# Altium schematic sheet motor endcap.SchDoc
size A; SheetNumber: 1; SheetTotal: 1
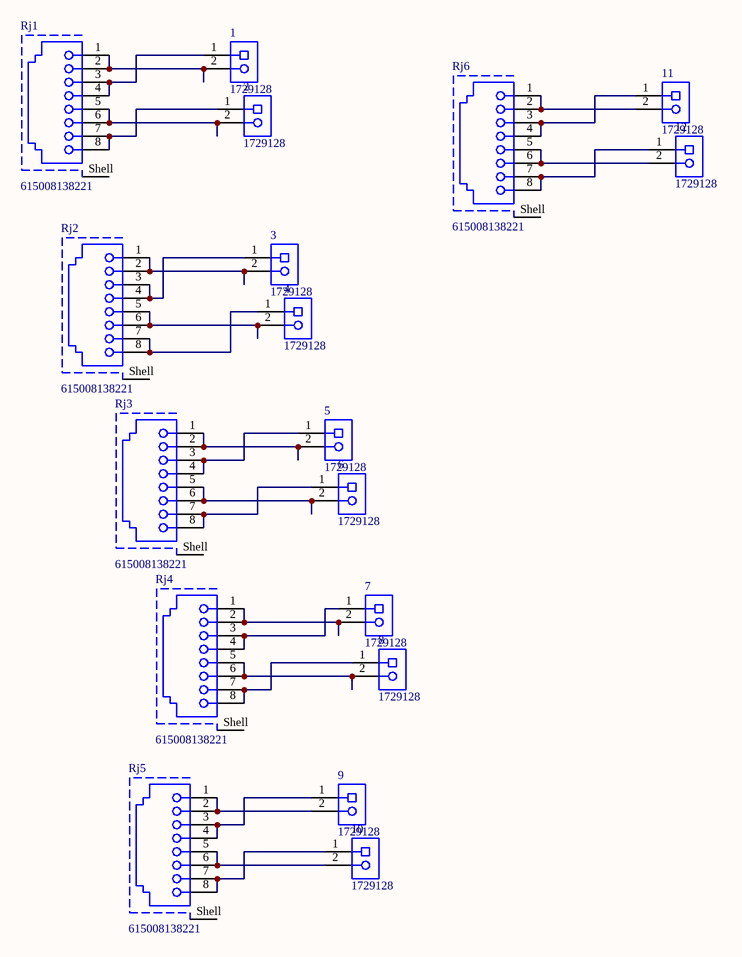
[diagram p0: motor endcap.SchDoc]

## Parts
1  1729128  [PHOE-1729128-2_V]
2  1729128  [PHOE-1729128-2_V]
3  1729128  [PHOE-1729128-2_V]
4  1729128  [PHOE-1729128-2_V]
5  1729128  [PHOE-1729128-2_V]
6  1729128  [PHOE-1729128-2_V]
7  1729128  [PHOE-1729128-2_V]
8  1729128  [PHOE-1729128-2_V]
9  1729128  [PHOE-1729128-2_V]
10  1729128  [PHOE-1729128-2_V]
11  1729128  [PHOE-1729128-2_V]
12  1729128  [PHOE-1729128-2_V]
Rj1  615008138221  [615008138221]
Rj2  615008138221  [615008138221]
Rj3  615008138221  [615008138221]
Rj4  615008138221  [615008138221]
Rj5  615008138221  [615008138221]
Rj6  615008138221  [615008138221]

## Nets
Net1_1: 1.1 Rj1.3 Rj1.4
Net1_2: 1.2 Rj1.1 Rj1.2
Net2_1: 2.1 Rj1.7 Rj1.8
Net2_2: 2.2 Rj1.5 Rj1.6
Net3_1: 3.1 Rj2.3 Rj2.4
Net3_2: 3.2 Rj2.1 Rj2.2
Net4_1: 4.1 Rj2.7 Rj2.8
Net4_2: 4.2 Rj2.5 Rj2.6
Net5_1: 5.1 Rj3.3 Rj3.4
Net5_2: 5.2 Rj3.1 Rj3.2
Net6_1: 6.1 Rj3.7 Rj3.8
Net6_2: 6.2 Rj3.5 Rj3.6
Net7_1: 7.1 Rj4.3 Rj4.4
Net7_2: 7.2 Rj4.1 Rj4.2
Net8_1: 8.1 Rj4.7 Rj4.8
Net8_2: 8.2 Rj4.5 Rj4.6
Net9_1: 9.1 Rj5.3 Rj5.4
Net9_2: 9.2 Rj5.1 Rj5.2
Net10_1: 10.1 Rj5.7 Rj5.8
Net10_2: 10.2 Rj5.5 Rj5.6
Net11_1: 11.1 Rj6.3 Rj6.4
Net11_2: 11.2 Rj6.1 Rj6.2
Net12_1: 12.1 Rj6.7 Rj6.8
Net12_2: 12.2 Rj6.5 Rj6.6

Not connected (* = marked no-connect by the designer): Rj1 Shell; Rj2 Shell; Rj3 Shell; Rj4 Shell; Rj5 Shell; Rj6 Shell

## Library data of the parts
1-12 = CMP-2000-05815-1: PCB Terminal Block, 13.5 A, 400 V, 2-Pin THD, RoHS, Bulk; Manufacturer: Phoenix Contact; Package Version: 03/2015; No. of Rows: 1; Pitch: 5.08mm; No. of Positions: 2; Voltage Rating: 400V; Current Rating: 13500mA; Manufacturer URL: http://www.phoenixcontact.com/; Datasheet URL: https://datasheet.ciiva.com/16046/1729128-16046181.pdf; RoHS: TRUE; Package URL: https://www.phoenixcontact.com/online/portal/pi/pxc/product_detail_page/!ut/p/b1/3VdJjqNKFDxLH8AFycySyWY2ozFsEPOMMQaDOX1XedGL_1Vdm5YXJleknhSKeBkvI6EA8ncAo3AYoDhBQGco6KN7VURTdemj9us_IEKEZo_YHiPAEWEFmDGOHMORkqKYCORBZxgL7ZoaZYcbFFUZ3fqxSY6GOuxydWUuHqz1ynmMFygu583Bob0Ewr6Sd_l-5m-kAueHiB0jpRwZwe58wwtkpxtMYd_LmGcDRU02dRNEyWt6Y2ti5pSyJ_reIkzIulrqApdnbT11V5jnCKbYNCvhEM1MCpPByat_X379-iThf08CI5GfOPqfBeS3BRoBOdD55AKVv0iLwCMq-2BrzXWSGRH7pUGD9uwXQjiph3xL0DKQwdGa0JImiIOmBNOestqgwTHSSs2oOep-78apyXQBvNi8ZLaFjvjWvcaUEBu0MC6Wbe-d6mB0FAebo2lUWinqYaZs5DAYzV0RP9yitUjnGJ0iI9xhZkT42OCQNUJJhkgWINNQLP2JFP6OpMg3JCVg70jqHT0lvKOnhHf0lPuOnnLf0VPuWx6_dxwUIvwk5WMkT0kLL1mh61l2yZVSzG3pYV_bqo-mj6uMKwKwdnnW8Jh5RTOJzMOA5c-eJDaZQw4mTMPH02PvS_ZAqNVjVTo2WyYLkwH_KU1mmmG5kjRhDqPXLwwVHvVOjCM60-fpXvTDfMGW1PVFVS1r4e4yVDk4ZdNbkUHvqPqQSeian4UD39fNKmachqdJ1NJbyk8rXT9mXTvPk3oE5meulKGgiruPJek-4I9hTT6G8ZLOyRSm2RRVbThERQad5OS28hdt4YW4vG0stgYYzsWsK4_7y6DZMjJSCqri1kyiZR5vD7pwIrNR7QwPHTcLTI5qT7eRlpHrdGiupYlqQDJ7zy_CND8fWWBoLRXxk1RVcXiBQwbTD4Xi7KL-FuO94t9xaqweXzH; PartNumber: 1729128; Package Description: 2-Pin Through Hole Device, Body 8.1 x 10.16 mm, Pitch 5.08 mm; Datasheet Version: 12/2013; Mounting Technology: ThroughHole; Orientation: Horizontal; Package Reference: 1729128-2; Packing: Bulk
Rj1-Rj6 = CMP-1502-01731-2: NexarPartId: 18818181; Direction: User Selectable; Current Rating: 1.5A; Number of Contacts: 8; Contact Resistance: 20mΩ; Connector Type: RJ45, Socket; Number of Ports: 1; Voltage Rating: 125V; Operating Supply Voltage: 120V; Shielding: Shielded; Gender: Female; Insulation Resistance: 500MΩ; REACH SVHC: Unknown; RoHS: Compliant; Color: Black; Depth: 16.4mm; Housing Material: PBT; Width: 15.9mm; Termination: Through Hole; Insulation Material: PBT; Contact Material: Copper; Max Operating Temperature: 85°C; Length: 16.65mm; Contact Plating: Gold; Min Operating Temperature: -40°C; Height: 16.65mm; Mount: Through Hole; Orientation: Vertical; Number of Rows: 1; Number of Positions: 8